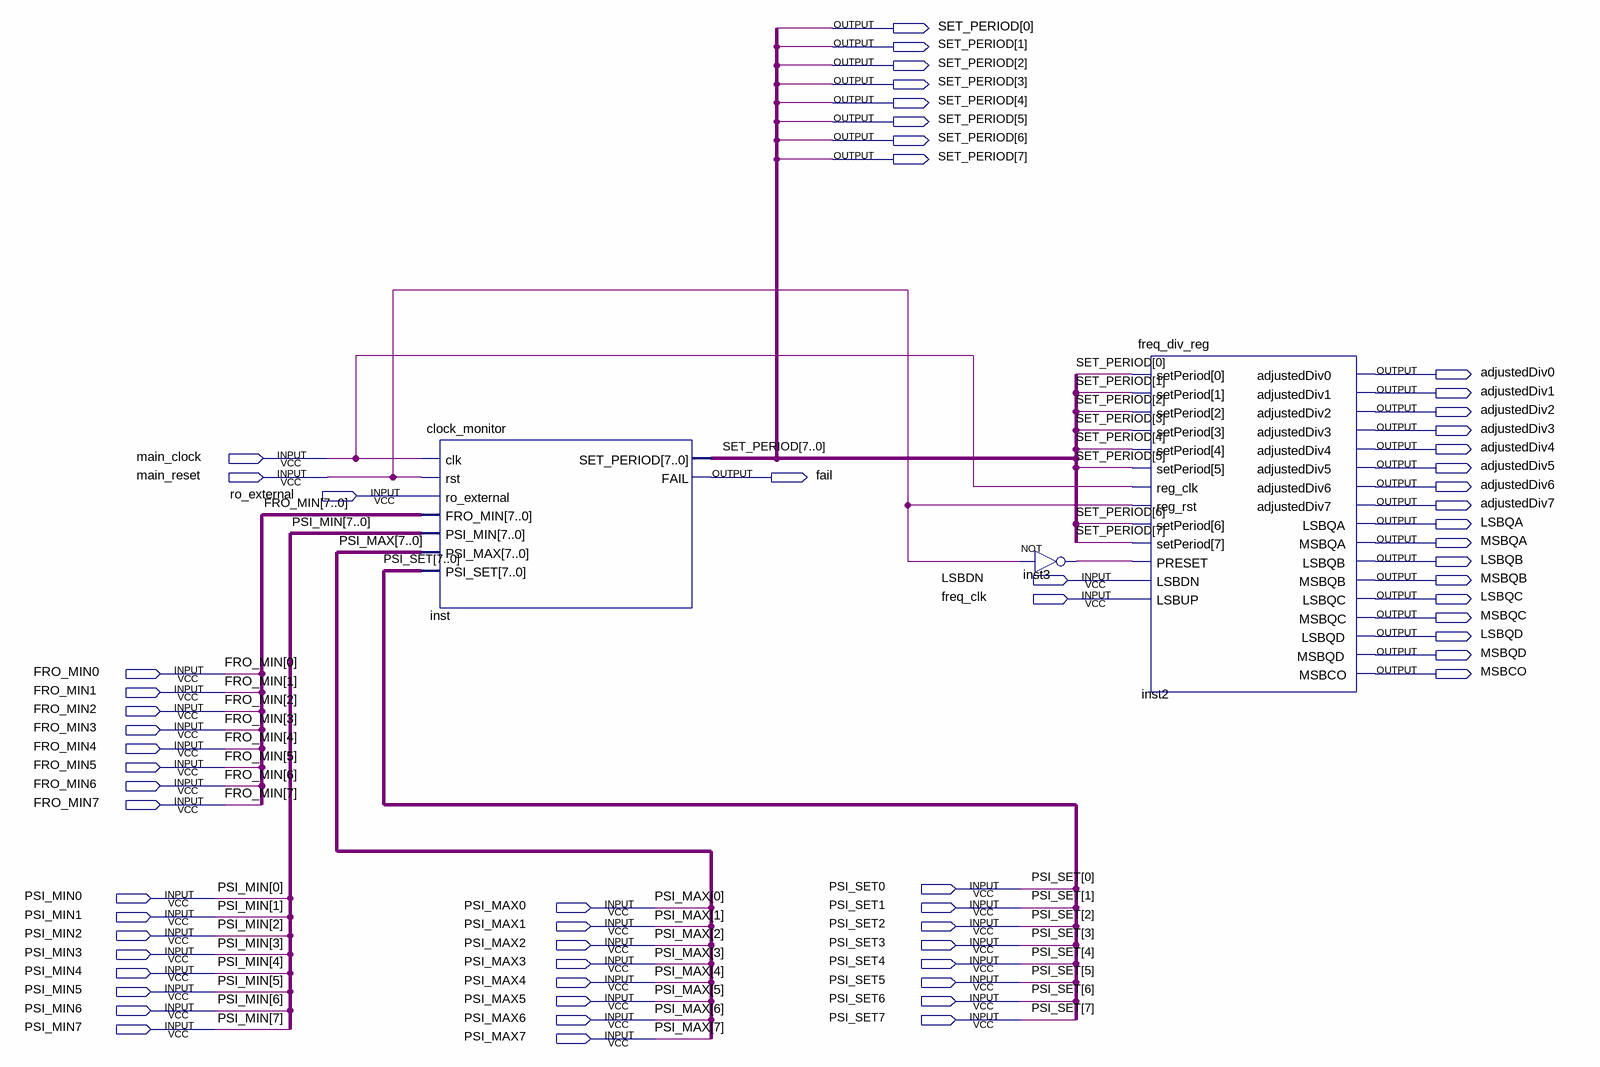
[diagram p0: schematic sheet]
// Quartus schematic reg_clk_mntr.bdf as structural Verilog: 3 symbols, 63 pins
module reg_clk_mntr (
  input  main_clock,
  input  main_reset,
  input  ro_external,
  input  LSBDN,
  input  freq_clk,
  input  FRO_MIN0,
  input  FRO_MIN1,
  input  FRO_MIN2,
  input  FRO_MIN3,
  input  FRO_MIN4,
  input  FRO_MIN5,
  input  FRO_MIN6,
  input  FRO_MIN7,
  input  PSI_SET0,
  input  PSI_MIN0,
  input  PSI_MAX0,
  input  PSI_SET1,
  input  PSI_MIN1,
  input  PSI_MAX1,
  input  PSI_SET2,
  input  PSI_MIN2,
  input  PSI_MAX2,
  input  PSI_SET3,
  input  PSI_MIN3,
  input  PSI_MAX3,
  input  PSI_SET4,
  input  PSI_MIN4,
  input  PSI_MAX4,
  input  PSI_SET5,
  input  PSI_MIN5,
  input  PSI_MAX5,
  input  PSI_SET6,
  input  PSI_MIN6,
  input  PSI_MAX6,
  input  PSI_SET7,
  input  PSI_MIN7,
  input  PSI_MAX7,
  output [7:0] SET_PERIOD,
  output adjustedDiv0,
  output adjustedDiv1,
  output adjustedDiv2,
  output adjustedDiv3,
  output adjustedDiv4,
  output adjustedDiv5,
  output fail,
  output adjustedDiv6,
  output adjustedDiv7,
  output LSBQA,
  output MSBQA,
  output LSBQB,
  output MSBQB,
  output LSBQC,
  output MSBQC,
  output LSBQD,
  output MSBQD,
  output MSBCO
);

  wire inst3_out;

  clock_monitor inst (
    .clk(main_clock), .rst(main_reset), .ro_external(ro_external),
    .FRO_MIN({FRO_MIN7, FRO_MIN6, FRO_MIN5, FRO_MIN4, FRO_MIN3, FRO_MIN2, FRO_MIN1, FRO_MIN0}),
    .PSI_MIN({PSI_MIN7, PSI_MIN6, PSI_MIN5, PSI_MIN4, PSI_MIN3, PSI_MIN2, PSI_MIN1, PSI_MIN0}),
    .PSI_MAX({PSI_MAX7, PSI_MAX6, PSI_MAX5, PSI_MAX4, PSI_MAX3, PSI_MAX2, PSI_MAX1, PSI_MAX0}),
    .PSI_SET({PSI_SET7, PSI_SET6, PSI_SET5, PSI_SET4, PSI_SET3, PSI_SET2, PSI_SET1, PSI_SET0}),
    .SET_PERIOD(SET_PERIOD), .FAIL(fail));
  not inst3 (inst3_out, main_reset);
  freq_div_reg inst2 (
    .setPeriod(SET_PERIOD), .reg_clk(main_clock), .reg_rst(main_reset), .PRESET(inst3_out), .LSBDN(LSBDN),
    .LSBUP(freq_clk), .adjustedDiv0(adjustedDiv0), .adjustedDiv1(adjustedDiv1), .adjustedDiv2(adjustedDiv2),
    .adjustedDiv3(adjustedDiv3), .adjustedDiv4(adjustedDiv4), .adjustedDiv5(adjustedDiv5),
    .adjustedDiv6(adjustedDiv6), .adjustedDiv7(adjustedDiv7), .LSBQA(LSBQA), .MSBQA(MSBQA), .LSBQB(LSBQB),
    .MSBQB(MSBQB), .LSBQC(LSBQC), .MSBQC(MSBQC), .LSBQD(LSBQD), .MSBQD(MSBQD), .MSBCO(MSBCO));
endmodule
